# EAGLE schematic ESP32-Softub (EAGLE 9.6.2)
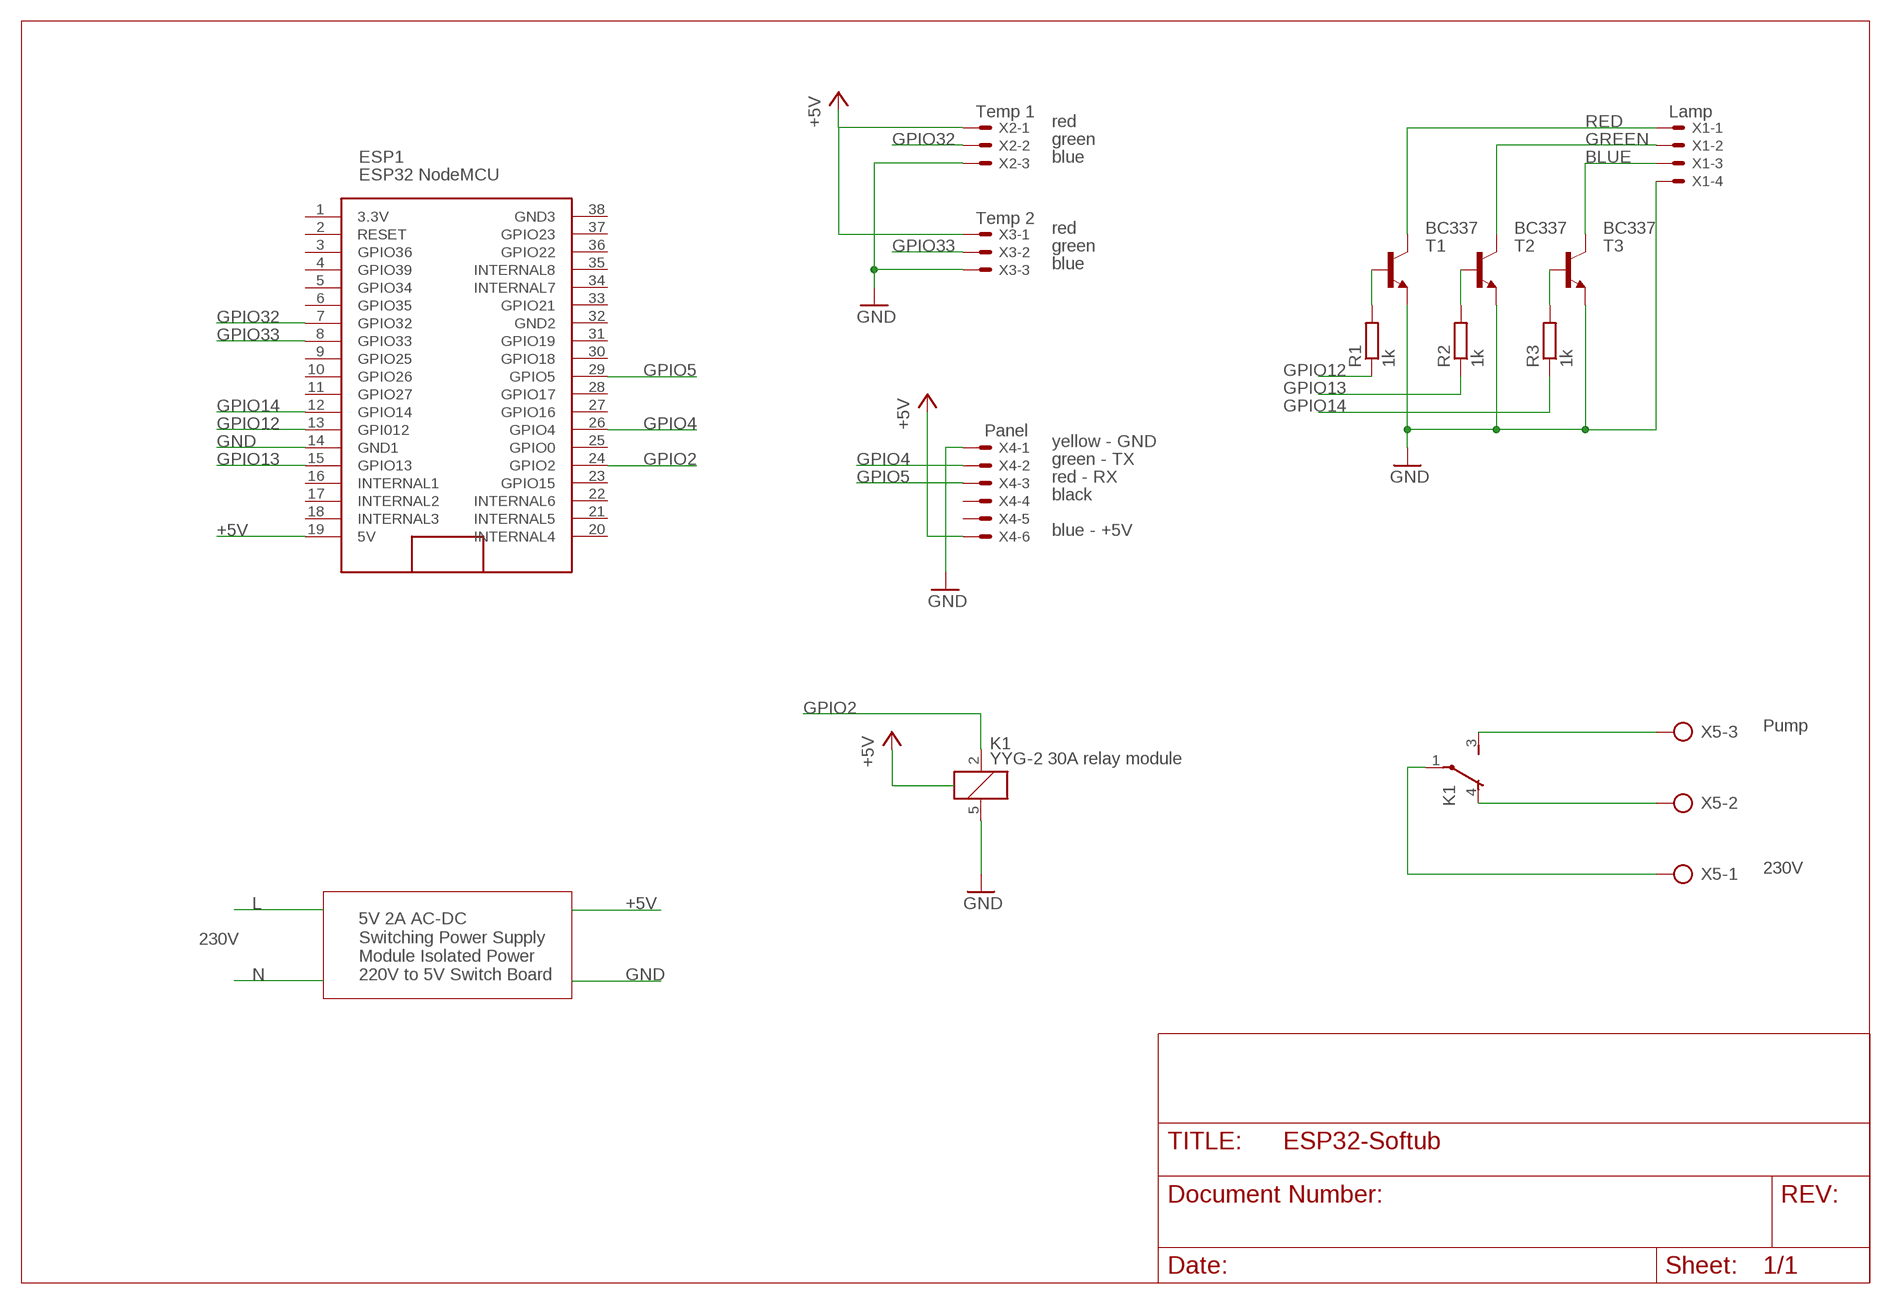
[diagram p0: schematic, sheet 1]

## Parts
ESP1  ESP32 NodeMCU  ESP32-NODEMCU  [ESP32_NODEMCU]
K1  YYG-2 30A relay module  AZ8-FORM-C  [AZ8]
R1  1k  R-EU_0309/12  [0309/12]
R2  1k  R-EU_0309/12  [0309/12]
R3  1k  R-EU_0309/12  [0309/12]
T1  BC337  [TO92]
T2  BC337  [TO92]
T3  BC337  [TO92]
X1  Lamp  22-23-2041  [22-23-2041]
X2  Temp 1  22-23-2031  [22-23-2031]
X3  Temp 2  22-23-2031  [22-23-2031]
X4  22-23-2061  [22-23-2061]
X5  AK500/3  [AK500/3]

## Nets
+5V: ESP1.19(5V) X2.1 X3.1 X4.6
BLUE: T3.3(C) X1.3
GND: ESP1.14(GND1) K1.5 T1.1(E) T2.1(E) T3.1(E) X1.4 X2.3 X3.3 X4.1
GPIO2: ESP1.24(GPIO2) K1.2
GPIO4: ESP1.26(GPIO4) X4.2
GPIO5: ESP1.29(GPIO5) X4.3
GPIO12: ESP1.13(GPI012) R1.1
GPIO13: ESP1.15(GPIO13) R2.1
GPIO14: ESP1.12(GPIO14) R3.1
GPIO32: ESP1.7(GPIO32) X2.2
GPIO33: ESP1.8(GPIO33) X3.2
GREEN: T2.3(C) X1.2
N$1: R1.2 T1.2(B)
N$2: R2.2 T2.2(B)
N$3: R3.2 T3.2(B)
N$4: K1.1(-1:P) X5.1
N$5: K1.3(-1:S) X5.3
N$6: K1.4(-1:O) X5.2
RED: T1.3(C) X1.1
Unconnected: ESP1.2(RESET) ESP1.3(GPIO36) ESP1.4(GPIO39) ESP1.5(GPIO34) ESP1.6(GPIO35) ESP1.9(GPIO25) ESP1.10(GPIO26) ESP1.11(GPIO27) ESP1.16(INTERNAL1) ESP1.17(INTERNAL2) ESP1.18(INTERNAL3) ESP1.20(INTERNAL4) ESP1.21(INTERNAL5) ESP1.22(INTERNAL6) ESP1.23(GPIO15) ESP1.25(GPIO0) ESP1.27(GPIO16) ESP1.28(GPIO17) ESP1.30(GPIO18) ESP1.31(GPIO19) ESP1.33(GPIO21) ESP1.34(INTERNAL7) ESP1.35(INTERNAL8) ESP1.36(GPIO22) ESP1.37(GPIO23) X4.4 X4.5

## Notes on the sheet
- red
- green
- blue
- red
- green
- blue
- Panel
- yellow - GND
- green - TX
- red - RX
- black
- blue - +5V
- Pump
- 230V
- 230V
- 5V 2A AC-DC 
  Switching Power Supply 
  Module Isolated Power 
  220V to 5V Switch Board

## Power pins joined to a net without a drawn wire
3.3V: ESP1.1(3.3V)
GND2: ESP1.32(GND2)
GND3: ESP1.38(GND3)

## Library data of the parts
ESP1 = _esp32:ESP32-NODEMCU
K1 = relay:AZ8-FORM-C: MINIATURE PC BOARD RELAY Form C Source: www.azettler.com .. AZ8-1ch-12DSE.PDF; OC_FARNELL: unknown; OC_NEWARK: unknown
R1-R3 = rcl:R-EU_: RESISTOR, European symbol; SPICEPREFIX: R
T1-T3 = transistor:BC337: NPN TRANSISTOR
X1 = con-molex:22-23-2041: .100" (2.54mm) Center Header - 4 Pin; MF: MOLEX; MPN: 22-23-2041; OC_FARNELL: 1462920; OC_NEWARK: 38C0355
X2 X3 = con-molex:22-23-2031: .100" (2.54mm) Center Header - 3 Pin; MF: MOLEX; MPN: 22-23-2031; OC_FARNELL: 1462950; OC_NEWARK: 30C0862
X4 = con-molex:22-23-2061: .100" (2.54mm) Center Header - 6 Pin; MF: MOLEX; MPN: 22-23-2061; OC_FARNELL: 1462922; OC_NEWARK: 27C1933
X5 = con-ptr500:AK500/3: CONNECTOR; OC_FARNELL: unknown; OC_NEWARK: unknown